# Altium schematic sheet Printhead.SchDoc: Printhead PCB
size A4; Organization: Altium Limited; Revision: 2012-K
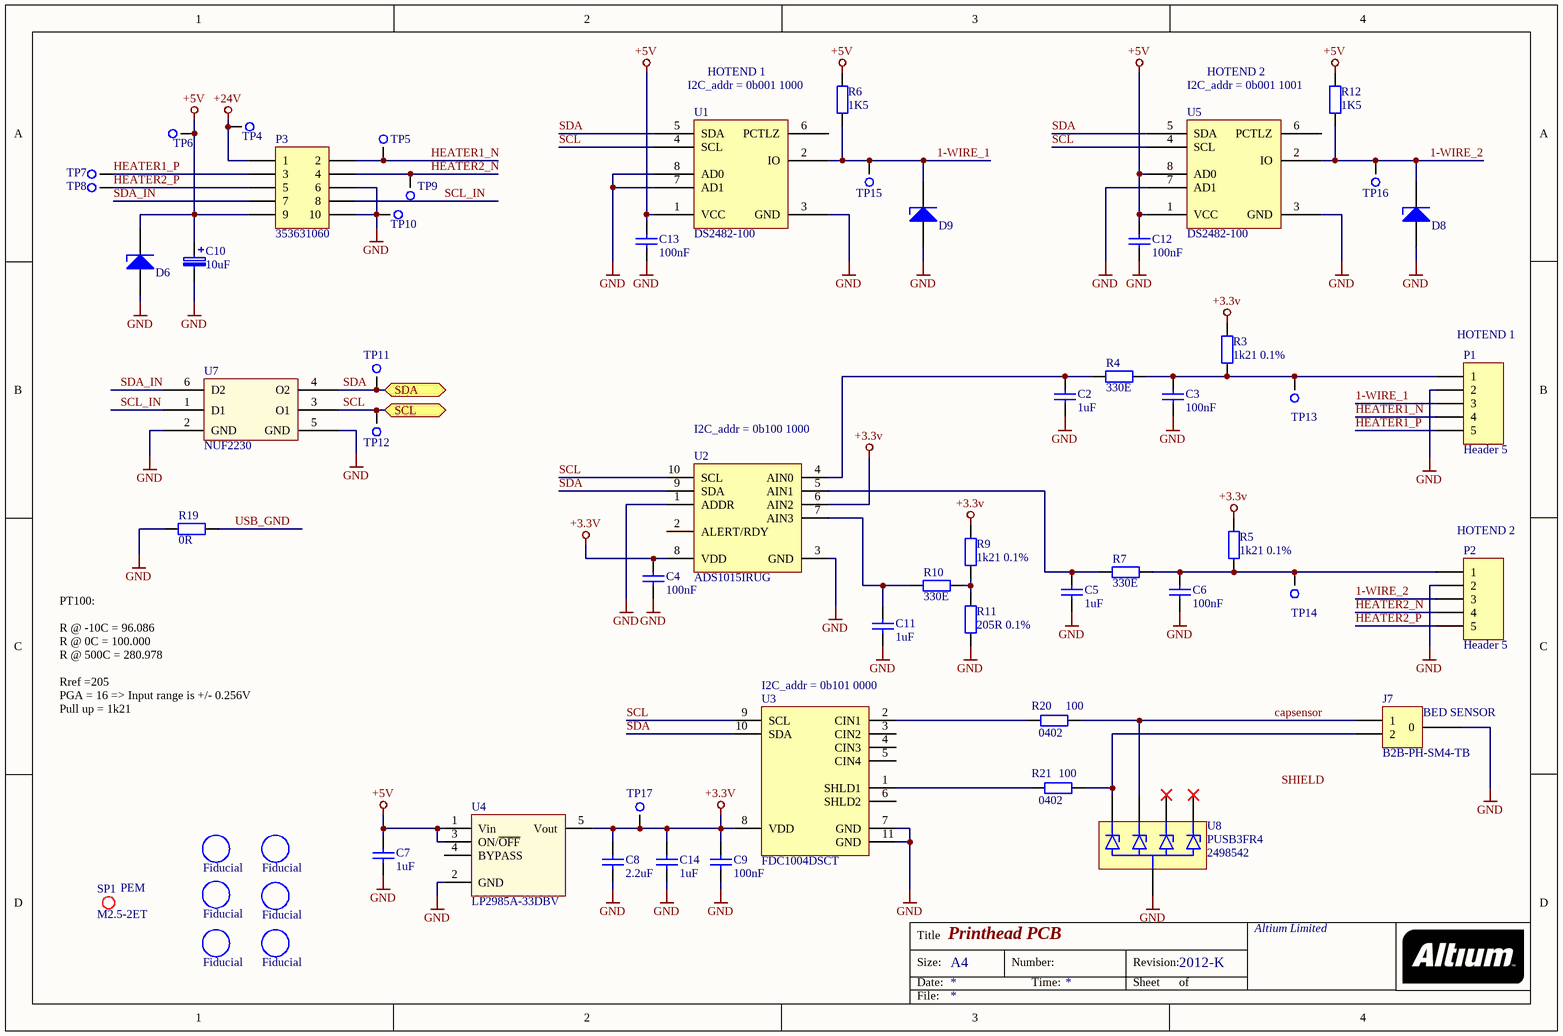
[diagram p0: Printhead.SchDoc]

## Parts
C2  1uF  [CAPC1608X09N]
C3  100nF  [CAPC1608X09N]
C4  100nF  [CAPC1608X09N]
C5  1uF  [CAPC1608X09N]
C6  100nF  [CAPC1608X09N]
C7  1uF  [CAPC1608X09N]
C8  2.2uF  [CAPC1608X09N]
C9  100nF  [CAPC1608X09N]
C10  10uF  [CAPMP3216X18N]
C11  1uF  [CAPC1608X09N]
C12  100nF  [CAPC1608X09N]
C13  100nF  [CAPC1608X09N]
C14  1uF  [CAPC1608X09N]
D6  ESD9X5.0ST5G  [SODFL100X40-2N]  (value not drawn)
D8  ESD9L5.0ST5G  [SODFL100X40-2N]  (value not drawn)
D9  ESD9L5.0ST5G  [SODFL100X40-2N]  (value not drawn)
Fid1  Fiducial  [Fiducial 1,5mm]  (no BOM)
Fid2  Fiducial  [Fiducial 1,5mm]  (no BOM)
Fid3  Fiducial  [Fiducial 1,5mm]  (no BOM)
Fid4  Fiducial  [Fiducial 1,5mm]  (no BOM)
Fid5  Fiducial  [Fiducial 1,5mm]  (no BOM)
Fid6  Fiducial  [Fiducial 1,5mm]  (no BOM)
J7  B2B-PH-SM4-TB  [B2B-PH-SM4-TB]
P1  Header 5  [AVX 9155005003016]
P2  Header 5  [AVX 9155005003016]
P3  353631060  [353631060]
R3  1k21 0.1%  [RESC1608X05N]
R4  330E  [RESC1608X05N]
R5  1k21 0.1%  [RESC1608X05N]
R6  1K5  [RESC1608X05N]
R7  330E  [RESC1608X05N]
R9  1k21 0.1%  [RESC1608X05N]
R10  330E  [RESC1608X05N]
R11  205R 0.1%  [RESC1608X05N]
R12  1K5  [RESC1608X05N]
R19  0R  [R1206]
R20  0402  Resistance: 100  [cap0402]
R21  0402  Resistance: 100  [cap0402]
SP1  M2.5-2ET  Mfg: PEM  [Spacer M25-2ET]
TP4  Testpoint 1.6mm  [Testpoint 1.6mm]  (value not drawn)
TP5  Testpoint 1.6mm  [Testpoint 1.6mm]  (value not drawn)
TP6  Testpoint 1.6mm  [Testpoint 1.6mm]  (value not drawn)
TP7  Testpoint 1.6mm  [Testpoint 1.6mm]  (value not drawn)
TP8  Testpoint 1.6mm  [Testpoint 1.6mm]  (value not drawn)
TP9  Testpoint 1.6mm  [Testpoint 1.6mm]  (value not drawn)
TP10  Testpoint 1.6mm  [Testpoint 1.6mm]  (value not drawn)
TP11  Testpoint 1.6mm  [Testpoint 1.6mm]  (value not drawn)
TP12  Testpoint 1.6mm  [Testpoint 1.6mm]  (value not drawn)
TP13  Testpoint 1.6mm  [Testpoint 1.6mm]  (value not drawn)
TP14  Testpoint 1.6mm  [Testpoint 1.6mm]  (value not drawn)
TP15  Testpoint 1.6mm  [Testpoint 1.6mm]  (value not drawn)
TP16  Testpoint 1.6mm  [Testpoint 1.6mm]  (value not drawn)
TP17  Testpoint 1.6mm  [Testpoint 1.6mm]  (value not drawn)
U1  DS2482-100  [SOIC127P600X175-8N]
U2  ADS1015IRUG  [TI-RUG10_V]
U3  FDC1004DSCT  [SON50P300X300X80-11N]
U4  LP2985A-33DBV  [SOT95P275X110-5N]
U5  DS2482-100  [SOIC127P600X175-8N]
U7  NUF2230  [SOTFL50P160X60-6N]
U8  PUSB3FR4  Supplier Part Number 1: 2498542  [QFN0P250X100X50-10N]

## Ports
SCL (bidir), SDA (bidir)

## Nets
+3.3V: C4.2 C8.2 C9.2 C14.2 R3.2 R5.2 R9.2 TP17.1 U2.6(AIN2) U2.8(VDD) U3.8(VDD) U4.5(Vout)
+5V: C7.2 C10.1 C12.2 C13.2 D6.1(K) P3.9 R6.2 R12.2 TP6.1 U1.1(VCC) U4.1(Vin) U4.3(ON/~{OFF}) U5.1(VCC) U5.8(AD0)
+24V: P3.1 TP4.1
GND: C2.1 C3.1 C4.1 C5.1 C6.1 C7.1 C8.1 C9.1 C10.2 C11.1 C12.1 C13.1 C14.1 D6.2(A) D8.2(A) D9.2(A) J7.0 P1.2 P2.2 P3.6 P3.10 R11.1 R19.2 TP10.1 U1.3(GND) U1.7(AD1) U1.8(AD0) U2.1(ADDR) U2.3(GND) U3.7(GND) U3.11(GND) U4.2(GND) U5.3(GND) U5.7(AD1) U7.2(GND) U7.5(GND) U8.3(GND)
1-WIRE_1: D9.1(K) P1.3 R6.1 TP15.1 U1.2(IO)
1-WIRE_2: D8.1(K) P2.3 R12.1 TP16.1 U5.2(IO)
capsensor: J7.1 R20.2 U8.2(Ch2)
HEATER1_N: P1.4 P3.2 TP5.1
HEATER1_P: P1.5 P3.3 TP7.1
HEATER2_N: P2.4 P3.4 TP9.1
HEATER2_P: P2.5 P3.5 TP8.1
SCL: TP12.1 U1.4(SCL) U2.10(SCL) U3.9(SCL) U5.4(SCL) U7.3(O1) ; port SCL
SCL_IN: P3.8 U7.1(D1)
SDA: TP11.1 U1.5(SDA) U2.9(SDA) U3.10(SDA) U5.5(SDA) U7.4(O2) ; port SDA
SDA_IN: P3.7 U7.6(D2)
USB_GND: R19.1
NetC2_2: C2.2 R4.1 U2.4(AIN0)
NetC3_2: C3.2 P1.1 R3.1 R4.2 TP13.1
NetC5_2: C5.2 R7.1 U2.5(AIN1)
NetC6_2: C6.2 P2.1 R5.1 R7.2 TP14.1
NetC11_2: C11.2 R10.1 U2.7(AIN3)
NetJ7_2: J7.2 R21.2 U8.1(Ch1)
NetR9_1: R9.1 R10.2 R11.2
NetR20_1: R20.1 U3.2(CIN1)
NetR21_1: R21.1 U3.1(SHLD1)

Not connected (* = marked no-connect by the designer): U1 6(PCTLZ); U2 2(ALERT/RDY); U3 3(CIN2) 4(CIN3) 5(CIN4) 6(SHLD2); U4 4(BYPASS); U5 6(PCTLZ); U8 4(Ch3)* 5(Ch4)*

## Notes on the sheet
- I2C_addr = 0b001 1000
- HOTEND 1
- (near R12) I2C_addr = 0b001 1001
- HOTEND 2
- (near P1) HOTEND 1
- (near U2) I2C_addr = 0b100 1000
- (near P2) HOTEND 2
- (near U3) I2C_addr = 0b101 0000
- (near J7) BED SENSOR
- PT100:
  R @ -10C = 96.086
  R @ 0C = 100.000
  R @ 500C = 280.978
  Rref =205
  PGA = 16 => Input range is +/- 0.256V
  Pull up = 1k21
- Labels drawn without touching a wire or pin: SHIELD
- Title
- Size:
- Date:
- A4
- Number:
- Time:
- Revision:
- Sheet
- of
- File:

## Library data of the parts
C2 C5 C7 C11 C14 = 1uF/10V/0603: CAP CER 1UF 10V 10% X5R 0603; Manufacturer: Murata Electronics North America; Manufacturer Part Number: GRM188R61A105KA61D; Capacitance: 1.0µF; Value: 1uF; Voltage - Rated: 10V; Supplier 1: Digi-Key; Supplier Part Number 1: 490-1543-6-ND; RoHS: RoHS Compliant; Category: Capacitors; Stock 1: 649155; Pricing 1: 1=0.15, 10=0.063, 50=0.0344, 100=0.0291, 250=0.02372, 500=0.02032, 1000=0.01583 (EUR); Tolerance: ±10%; Temperature Coefficient: X5R; Mounting Type: Surface Mount, MLCC; Operating Temperature: -55°C ~ 85°C; Applications: General Purpose; Ratings: -; Package / Case: 0603 (1608 Metric); Size / Dimension: 0.063" L x 0.031" W (1.60mm x 0.80mm); Height - Seated (Max): -; Thickness (Max): 0.035" (0.90mm); Lead Spacing: -; Features: -; Packaging: Digi-Reel®; Lead Style: -; ComponentLink1URL: http://psearch.murata.com/capacitor/product/GRM188R61A105KA61#.pdf; ComponentLink1Description: http://psearch.murata.com/capacitor/product/GRM188R61A105KA61#.pdf; Mfg: Murata Electronics North America; Mfg code: GRM188R61A105KA61D
C3 C4 C6 C9 C12 C13 = 100nF/50V/0603: CAP CER 0.1UF 50V 10% X7R 0603; Manufacturer: Yageo; Manufacturer Part Number: CC0603KRX7R9BB104; Capacitance: 0.1µF; PackageReference: RAD-0.3; PackageDescription: Radial Cap, Thru-Hole; 2 Leads; 0.3 in Pin Spacing; Value: 100nF; Supplier 1: Digi-Key; RoHS: RoHS Compliant; Category: Capacitors; Stock 1: 1634380; Pricing 1: 1=0.09, 10=0.023, 25=0.0164, 100=0.0106, 250=0.00868, 500=0.00742, 1000=0.00578 (EUR); Voltage - Rated: 50V; Tolerance: ±10%; Temperature Coefficient: X7R; Mounting Type: Surface Mount, MLCC; Operating Temperature: -55°C ~ 125°C; Applications: General Purpose; Ratings: -; Package / Case: 0603 (1608 Metric); Size / Dimension: 0.063" L x 0.031" W (1.60mm x 0.80mm); Height - Seated (Max): -; Thickness (Max): 0.035" (0.90mm); Lead Spacing: -; Features: -; Packaging: Cut Tape (CT); Lead Style: -; ComponentLink1URL: http://www.yageo.com/documents/recent/UPY-GPHC_X7R_6.3V-to-50V_8.pdf; ComponentLink1Description: http://www.yageo.com/documents/recent/UPY-GPHC_X7R_6.3V-to-50V_8.pdf; Supplier Part Number 1: 311-1344-1-ND; Mfg: Yageo; Mfg code: CC0603KRX7R9BB104
C8 = 2.2.uF/10V/0603: CAP CER 2.2UF 10V 20% X5R 0603; Manufacturer: Murata Electronics North America; Manufacturer Part Number: GRM188R61A225ME34D; Capacitance: 2.2µF; Value: 2.2uF; Voltage - Rated: 10V; Supplier 1: Digi-Key; Supplier Part Number 1: 490-1546-6-ND; RoHS: RoHS Compliant; Category: Capacitors; Stock 1: 64441; Pricing 1: 1=0.17, 10=0.113, 50=0.0652, 100=0.0539, 250=0.04536, 500=0.03798, 1000=0.03119 (EUR); Tolerance: ±20%; Temperature Coefficient: X5R; Mounting Type: Surface Mount, MLCC; Operating Temperature: -55°C ~ 85°C; Applications: General Purpose; Ratings: -; Package / Case: 0603 (1608 Metric); Size / Dimension: 0.063" L x 0.031" W (1.60mm x 0.80mm); Height - Seated (Max): -; Thickness (Max): 0.035" (0.90mm); Lead Spacing: -; Features: -; Packaging: Digi-Reel®; Lead Style: -; ComponentLink1URL: http://psearch.murata.com/capacitor/product/GRM188R61A225ME34#.pdf; ComponentLink1Description: http://psearch.murata.com/capacitor/product/GRM188R61A225ME34#.pdf; Mfg: Murata Electronics North America; Mfg code: GRM188R61A225ME34D
C10 = 10uF/10V/SizeA: CAP TANT 10UF 10V 20% 1206; Manufacturer: Nichicon; Manufacturer Part Number: F931A106MAA; Manufacturer Size Code: A; Capacitance: 10µF; ESR (Equivalent Series Resistance): 3 Ohm; Type: Molded; Voltage - Rated: 10V; VALUE: 10uF; Supplier 1: Digi-Key; Supplier Part Number 1: 493-2351-6-ND; RoHS: RoHS Compliant; Category: Capacitors; Stock 1: 431417; Pricing 1: 1=0.42, 10=0.326, 100=0.1706, 250=0.12608, 500=0.0979, 1000=0.07713 (EUR); Tolerance: ±20%; Operating Temperature: -55°C ~ 125°C; Mounting Type: Surface Mount; Package / Case: 1206 (3216 Metric); Size / Dimension: 0.126" L x 0.063" W (3.20mm x 1.60mm); Height - Seated (Max): 0.071" (1.80mm); Lead Spacing: -; Features: General Purpose; Packaging: Digi-Reel®; Lifetime @ Temp.: -; ComponentLink1URL: http://www.nichicon.co.jp/english/products/pdfs/e-f93.pdf; ComponentLink1Description: http://www.nichicon.co.jp/english/products/pdfs/e-f93.pdf; Mfg: Nichicon; Mfg code: F931A106MAA
D6 = ESD9X5.0ST5G: TVS DIODE 5VWM 12.3VC SOD923; Mfg: ON Semiconductor; Type: Zener; Unidirectional Channels: 1; Voltage - Reverse Standoff (Typ): 5V (Max); Voltage - Breakdown (Min): 6.2V; Voltage - Clamping (Max) @ Ipp: 12.3V; Current - Peak Pulse (10/1000µs): 8.7A (8/20µs); Power - Peak Pulse: 107W; Power Line Protection: No; Capacitance @ Frequency: 65pF @ 1MHz; Supplier 1: Digi-Key; Supplier Part Number 1: ESD9X5.0ST5GOSTR-ND; Mfg code: ESD9X5.0ST5G; RoHS: RoHS Compliant; Category: Circuit Protection; Stock: 40000; Pricing: 8000=0.02337, 16000=0.02032, 24000=0.01829, 56000=0.01626, 200000=0.01351 (EUR); Packaging: Tape & Reel (TR); Bidirectional Channels: -; Applications: General Purpose; Operating Temperature: -55°C ~ 150°C (TJ); Mounting Type: Surface Mount; Package / Case: SOD-923; Supplier Device Package: SOD-923; ComponentLink1URL: http://www.onsemi.com/pub_link/Collateral/ESD9X3.3ST5G-D.PDF; ComponentLink1Description: http://www.onsemi.com/pub_link/Collateral/ESD9X3.3ST5G-D.PDF
D8 D9 = ESD9L5.0ST5G: Mfg: ON Semiconductor; Type: Zener; Unidirectional Channels: 1; Voltage - Reverse Standoff (Typ): 5V (Max); Voltage - Breakdown (Min): 5.4V; Voltage - Clamping (Max) @ Ipp: 9.8V; Current - Peak Pulse (10/1000µs): 1A (8/20µs); Power Line Protection: No; Capacitance @ Frequency: 0.5pF @ 1MHz; Supplier 1: Digi-Key; Supplier Part Number 1: ESD9L5.0ST5GOSTR-ND; Mfg code: ESD9L5.0ST5G; RoHS: RoHS Compliant; Category: Circuit Protection; Stock: 40000; Pricing: 8000=0.06409, 16000=0.05697, 24000=0.05341, 56000=0.04735, 200000=0.04557 (EUR); Packaging: Tape & Reel (TR); Bidirectional Channels: -; Power - Peak Pulse: -; Applications: Automotive; Operating Temperature: -55°C ~ 150°C (TJ); Mounting Type: Surface Mount; Package / Case: SOD-923; Supplier Device Package: SOD-923; ComponentLink1URL: http://www.onsemi.com/pub_link/Collateral/ESD9L-D.PDF; ComponentLink1Description: http://www.onsemi.com/pub_link/Collateral/ESD9L-D.PDF
Fid1-Fid6 = Library_MISC-0003: ID: Library_MISC-0003; Faber ItemCode: -; Mfg: -; Mfg code: -; Value: Fiducial
J7 = Header 2: JST B2B-PH-SM4-TB; Mfg: JST; Mfg code: B2B-PH-SM4-TB; Manufacturer: JST; Manufacturer Part Number: B2B-PH-SM4-TB
P1 P2 = Header 5: Header, 5-Pin; Manufacturer: AVX Interconnect; Manufacturer Part Number: 9155005003016; LatestRevisionDate: 17-Jul-2002; LatestRevisionNote: Re-released for DXP Platform.; Publisher: Altium Limited; Mfg: AVX Interconnect; Mfg code: 9155005003016
P3 = Header 5X2: Molex 353631060; Mfg: Molex; Mfg code: 353631060; Manufacturer: Molex; Manufacturer Part Number: 353631060
R3 R5 R9 = 1k21/0.1%/0603: RES 1.21K OHM 1/16W 0.1% 0603; Manufacturer: Stackpole Electronics Inc; Manufacturer Part Number: RNCF0603BTE1K21; Power (Watts): 0.063W, 1/16W; Temperature Coefficient: ±25ppm/°C; Supplier 1: Digi-Key; Supplier Part Number 1: RNCF0603BTE1K21CT-ND; RoHS: RoHS Compliant; Category: Resistors; Stock 1: 15488; Pricing 1: 1=0.7, 10=0.475, 50=0.2876, 100=0.2375, 250=0.18752, 500=0.16, 1000=0.12, 2500=0.1125 (USD); Packaging: Cut Tape (CT); Resistance (Ohms): 1.21k; Tolerance: ±0.1%; Composition: Thin Film; Features: Moisture Resistant; Operating Temperature: -55°C ~ 155°C; Package / Case: 0603 (1608 Metric); Supplier Device Package: 0603; Size / Dimension: 0.063" L x 0.031" W (1.60mm x 0.80mm); Height: 0.022" (0.55mm); Number of Terminations: 2; ComponentLink1URL: http://www.seielect.com/Catalog/SEI-RNCF.pdf; ComponentLink1Description: http://www.seielect.com/Catalog/SEI-RNCF.pdf; Mfg: Stackpole Electronics Inc; Mfg code: RNCF0603BTE1K21
R4 R7 R10 = 330E/0603: RES 330 OHM 1/10W 1% 0603 SMD; Manufacturer: Vishay Dale; Manufacturer Part Number: CRCW0603330RFKEA; VALUE: 10; Resistance (Ohms): 330; Power (Watts): 0.1W, 1/10W; Temperature Coefficient: ±100ppm/°C; Supplier 1: Digi-Key; Supplier Part Number 1: 541-330HDKR-ND; RoHS: RoHS Compliant; Category: Resistors; Stock 1: 34990; Pricing 1: 10=0.069, 50=0.037, 200=0.02135, 1000=0.01454 (EUR); Composition: Thick Film; Features: Automotive AEC-Q200 Qualified; Tolerance: ±1%; Package / Case: 0603 (1608 Metric); Supplier Device Package: 0603 (1608 Metric); Size / Dimension: 0.061" L x 0.033" W (1.55mm x 0.85mm); Height: 0.020" (0.50mm); Number of Terminations: 2; Packaging: Digi-Reel®; ComponentLink1URL: http://www.vishay.com/doc?20035; ComponentLink1Description: http://www.vishay.com/doc?20035; Mfg: Vishay Dale; Mfg code: CRCW0603330RFKEA
R6 R12 = Res 4.7K 0805: Res 1K5 0603 1% 100mW; Mfg: VISHAY DRALORIC; Mfg code: CRCW06031K50FKEA; Remarks: -; Value: 1K5; SMD: Yes; Supplier: Farnell; Supplier code: 2122385; Manufacturer: VISHAY DRALORIC; Manufacturer Part Number: CRCW06031K50FKEA
R11 = 205/0.1%/0603: RES 205 OHM 1/10W .1% 0603 SMD; Manufacturer: Panasonic Electronic Components; Manufacturer Part Number: ERA-3AEB2050V; Resistance (Ohms): 205; Power (Watts): 0.1W, 1/10W; Temperature Coefficient: ±25ppm/°C; Supplier 1: Digi-Key; Supplier Part Number 1: P205DBCT-ND; RoHS: RoHS Compliant; Category: Resistors; Stock 1: 11326; Pricing 1: 1=0.63, 50=0.2494, 100=0.1924, 250=0.14964, 500=0.10546, 1000=0.07695 (USD); Packaging: Cut Tape (CT); Tolerance: ±0.1%; Composition: Thin Film; Features: Automotive AEC-Q200 Qualified; Operating Temperature: -55°C ~ 155°C; Package / Case: 0603 (1608 Metric); Supplier Device Package: 0603; Size / Dimension: 0.063" L x 0.031" W (1.60mm x 0.80mm); Height: 0.022" (0.55mm); Number of Terminations: 2; ComponentLink1URL: http://industrial.panasonic.com/www-cgi/jvcr13pz.cgi?E+PZ+3+AOA0026+ERA3AEB2050V+7+WW; ComponentLink1Description: http://industrial.panasonic.com/www-cgi/jvcr13pz.cgi?E+PZ+3+AOA0026+ERA3AEB2050V+7+WW; Mfg: Panasonic Electronic Components; Mfg code: ERA-3AEB2050V
R19 = Library_RES-0001: RO RES 0R 1% 0,25W 1206; Mfg: VISHAY DRALORIC; Mfg code: CRCW12060000Z0EA; Value: 0R; Farnell code: 2123636
R20 R21 = R0402: 100E 1%; Manufacturer: VISHAY; Manufacturer Part Number: CRCW0402100RFKED; Product Range: AEC-Q200 CRCW Series; Voltage Rating: 50; Resistor Case Style: 0402 [1005 Metric]; Power Rating: 63; Resistor Element Material: Thick Film; Temperature Coefficient: ± 100; No. of Pins: 2; Resistor Mounting: Surface Mount Device<!--FANDB--><div class="features-and-benefits-container"><div class="features-and-benefits-description"><span class="features-benefits-value">The Vishay D/CRCW e3 series are standard thick film chip resistors. The resistance range includes E96 and E24 decade values from 1ohm to 10Mohm. CRCW e3 series resistors have a pure tin solder contacts on the Ni barrier layer that provides compatibility with reflow soldering process.</span></div><div class="features-and-benefits-list"><ul class="features-and-benefits-list-list"><li class="features-and-benefits-list-item">Automotive grade AEC-Q200 qualified</li><li class="features-and-benefits-list-item">EIA 0402, 0603, 0805, 1206, 1210, 1218, 2010, 2512 standard case sizes available</li><li class="features-and-benefits-list-item">Stability &Delta; Supplier 1: Farnell; Supplier Part Number 1: 1469672; RoHS: Y-EX; Stock 1: 46039; Pricing 1: 10=0.0087, 400=0.0066, 1000=0.0047, 2500=0.0043, 5000=0.0041 (GBP); Resistance Tolerance: ± 1%; Packaging: Cut Tape; MSL: MSL 1 - Unlimited; Operating Temperature Max: 155; Operating Temperature Min: -55; Operating Temperature Range: -55°C to +155; ComponentLink1URL: http://www.farnell.com/datasheets/2045673.pdf; ComponentLink1Description: http://www.farnell.com/datasheets/2045673.pdf; ComponentLink2URL: http://www.farnell.com/cad/1551213.zip; ComponentLink2Description: http://www.farnell.com/cad/1551213.zip
SP1 = Spacer M3-10ET: MOER-SMD SMTSO-M25-2ET  PEM; Mfg code: SMTSO-M25-2ET; Value: -; Remarks: -; Supplier: Onkenhout & Onkenhout; Supplier code: SMTSO-M25-2ET; Max soldering temp: -; SMD: Yes; Manufacturer: PEM; Manufacturer Part Number: SMTSO-M25-2ET
TP4-TP17 = Testpoint 1.6mm: ID: Library_MISC-0001; Faber ItemCode: -; Mfg: -; Mfg code: -; Info: Testpoint 1.6mm; Value: Testpoint 1.6mm
U1 = DS2482-100: Single-Channel 1-Wire Master; Mfg: Maxim Integrated; Mfg code: DS2482S-100+T&R; Manufacturer: Maxim Integrated; Manufacturer Part Number: DS2482S-100+T&R
U2 = ADS1015IRUG: 12-Bit ADC with Integrated Multiplexer, PGA, Comparator, Oscillator, and Reference, -40 to 125 degC, 10-pin X2QFN (RUG10), Green (RoHS & no Sb/Br); Manufacturer: Texas Instruments; Manufacturer Part Number: ADS1015IRUGT; Number of Bits: 12; Sampling Rate (Per Second): 3.3k; Number of Inputs: 2, 4; Input Type: Differential, Single Ended; Data Interface: I²C; Configuration: MUX-PGA-ADC; Ratio - S/H:ADC: 1:1; Number of A/D Converters: 1; Architecture: Sigma-Delta; Reference Type: Internal; Voltage - Supply, Analog: 2 V ~ 5.5 V; Supplier 1: Digi-Key; Supplier Part Number 1: 296-25172-1-ND; RoHS: RoHS Compliant; Category: Integrated Circuits (ICs); Stock 1: 1996; Pricing 1: 1=3.42, 10=3.065, 25=2.756, 100=2.5067 (USD); Packaging: Cut Tape (CT); Voltage - Supply, Digital: 2 V ~ 5.5 V; Features: PGA; Operating Temperature: -40°C ~ 125°C; Package / Case: 10-XFQFN; Supplier Device Package: 10-X2QFN (2x1.5); ComponentLink1URL: http://www.ti.com/lit/ds/symlink/ads1013.pdf; ComponentLink1Description: http://www.ti.com/lit/ds/symlink/ads1013.pdf; Mfg: Texas Instruments; Mfg code: ADS1015IRUGT
U3 = FDC1004DSCT: IC CAPACITIVE SENSING 4CH 10WSON; Manufacturer: Texas Instruments; Supplier 1: Digi-Key; Supplier Part Number 1: FDC1004DSCT-ND; Manufacturer Part Number: FDC1004DSCT; RoHS: RoHS Compliant; Category: Sensors, Transducers; Stock 1: 0; Pricing 1: 250=4.4064 (USD); ComponentLink1URL: http://www.ti.com/lit/ds/symlink/fdc1004.pdf; ComponentLink1Description: http://www.ti.com/lit/ds/symlink/fdc1004.pdf; Mfg: Texas Instruments; Mfg code: FDC1004DSCT
U4 = LP2985A-33DBV: IC REG LDO 3.3V 0.15A SOT23-5; Manufacturer: Texas Instruments; Manufacturer Part Number: LP2985-33DBVR; Regulator Topology: Positive Fixed; Current - Output: 150mA; Voltage - Dropout (Typical): 0.28V @ 150mA; Number of Regulators: 1; Voltage - Input: Up to 16V; Supplier 1: Digi-Key; Supplier Part Number 1: 296-18476-1-ND; RoHS: RoHS Compliant; Category: Integrated Circuits (ICs); Stock 1: 34037; Pricing 1: 1=0.62, 10=0.542, 25=0.4784, 100=0.417, 250=0.363, 500=0.309, 750=0.27, 1000=0.2475 (USD); Packaging: Cut Tape (CT); Voltage - Output: 3.3V; Current - Limit (Min): -; Operating Temperature: -40°C ~ 125°C; Mounting Type: Surface Mount; Package / Case: SC-74A, SOT-753; Supplier Device Package: SOT-23-5; ComponentLink1URL: http://www.ti.com/lit/ds/symlink/lp2985-18.pdf; ComponentLink1Description: http://www.ti.com/lit/ds/symlink/lp2985-18.pdf; Mfg: Texas Instruments; Mfg code: LP2985-33DBVR
U5 = DS2482-100: Single-Channel 1-Wire Master; Manufacturer: Maxim Integrated; Manufacturer Part Number: DS2482S-100+T&R; Mfg: Maxim Integrated; Mfg code: DS2482S-100+T&R
U7 = NUF2230: Mfg: ON Semiconductor; Mfg code: NUF2230XV6T1G; Filter Order: 2nd; Number of Channels: 2; Center / Cutoff Frequency: 125MHz (Cutoff); Attenuation Value: 30dB @ 800MHz ~ 900MHz; Resistance - Channel (Ohms): 100; Values: R = 100 Ohms, C = 16pF; ESD Protection: Yes; Supplier 1: Digi-Key; Supplier Part Number 1: NUF2230XV6T1GOSCT-ND; RoHS: RoHS Compliant; Category: Filters; Stock: 3048; Pricing: 1=0.27, 10=0.252, 25=0.2404, 50=0.2326, 100=0.2248, 250=0.21316, 500=0.17828, 1000=0.13836 (EUR); Packaging: Cut Tape (CT); Type: Low Pass; Technology: RC (Pi); Current: -; Operating Temperature: -40°C ~ 85°C; Applications: Data Lines for Mobile Devices; Package / Case: SOT-563, SOT-666; Size / Dimension: 0.063" L x 0.047" W (1.60mm x 1.20mm); Height: 0.024" (0.60mm); ComponentLink1URL: http://www.onsemi.com/pub_link/Collateral/NUF2230XV6-D.PDF; ComponentLink1Description: http://www.onsemi.com/pub_link/Collateral/NUF2230XV6-D.PDF
U8 = PUSB3FR4: 4 lines ESD protection; Manufacturer: NXP; Clamping Voltage Vc Max: 3; Diode Case Style: DFN2510; No. of Pins: 10; Operating Voltage: 3.3; Product Range: PUSB3 Series; SVHC: No SVHC (17-Dec-2015); Supplier 1: Farnell; Manufacturer Part Number: PUSB3FR4; RoHS: YES; Stock 1: 2832; Pricing 1: 1=0.3, 25=0.284, 100=0.178, 250=0.156, 500=0.134, 1000=0.0812 (GBP); Power Dissipation Pd: -; Packaging: Cut Tape; MSL: MSL 1 - Unlimited<!--FANDB--><div class="features-and-benefits-container"></div>; ComponentLink1URL: http://www.farnell.com/datasheets/1961315.pdf; ComponentLink1Description: http://www.farnell.com/datasheets/1961315.pdf